# EAGLE schematic Sturingsschakeling_schema_v3.0 (EAGLE 9.7.0)
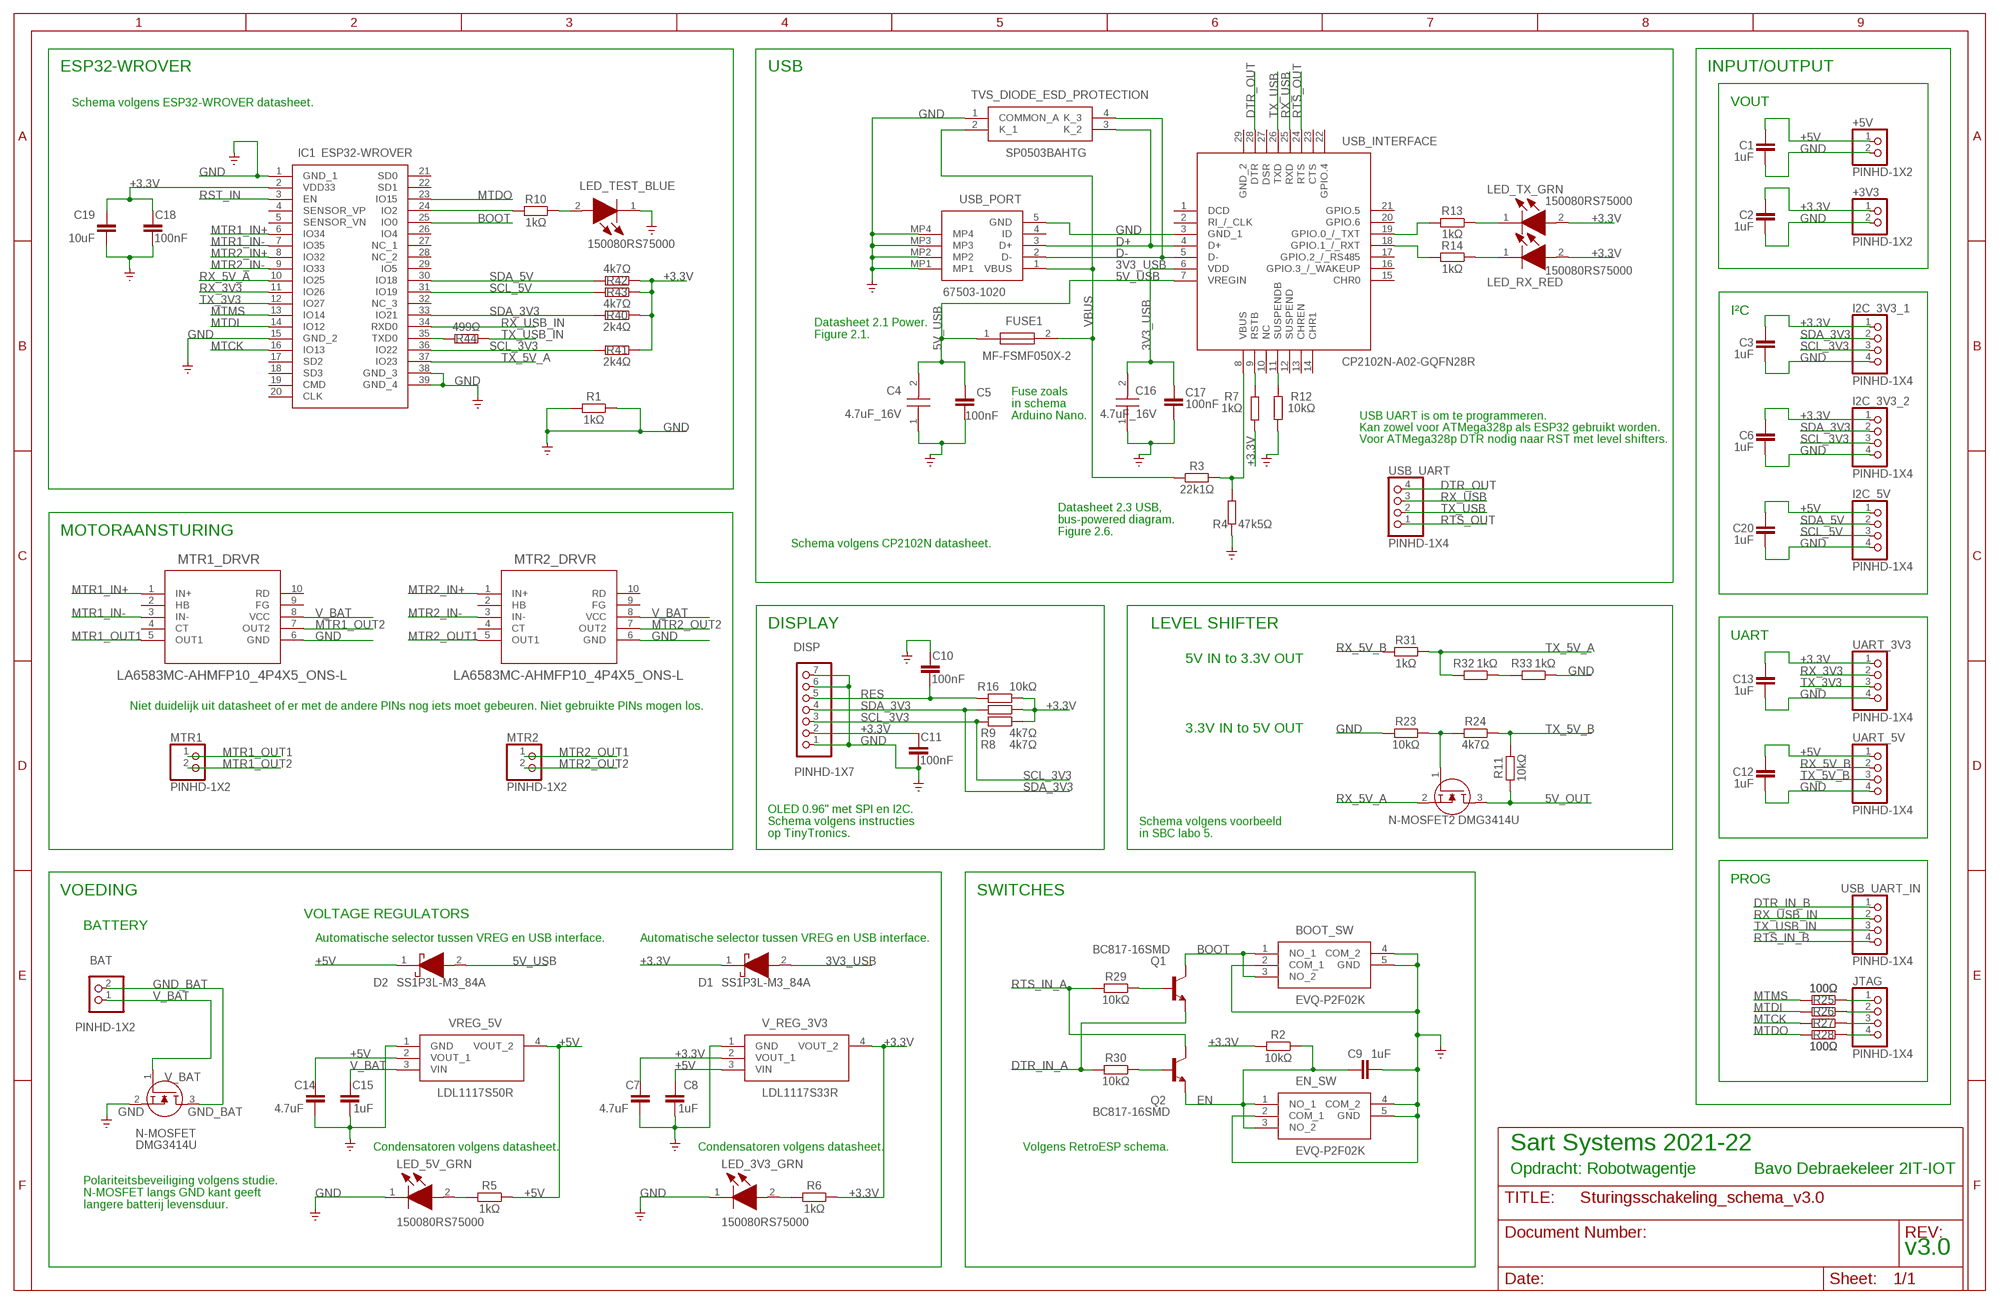
[diagram p0: schematic, sheet 1]

## Parts
+3V3  PINHD-1X2  [1X02]
+5V  PINHD-1X2  [1X02]
BAT  PINHD-1X2  [1X02]
BOOT_SW  EVQ-P2F02K  [EVQP2V02W]
C1  1uF  C_CHIP-0805(2012-METRIC)  [CAPC2012X110]
C2  1uF  C_CHIP-0805(2012-METRIC)  [CAPC2012X110]
C3  1uF  C_CHIP-0805(2012-METRIC)  [CAPC2012X110]
C4  4.7uF_16V  CC0805ZKY5V7BB475  [CAPC2012X145N]
C5  100nF  C_CHIP-0805(2012-METRIC)  [CAPC2012X110]
C6  1uF  C_CHIP-0805(2012-METRIC)  [CAPC2012X110]
C7  4.7uF  C_CHIP-0805(2012-METRIC)  [CAPC2012X110]
C8  1uF  C_CHIP-0805(2012-METRIC)  [CAPC2012X110]
C9  1uF  C_CHIP-0805(2012-METRIC)  [CAPC2012X110]
C10  100nF  C_CHIP-0805(2012-METRIC)  [CAPC2012X110]
C11  100nF  C_CHIP-0805(2012-METRIC)  [CAPC2012X110]
C12  1uF  C_CHIP-0805(2012-METRIC)  [CAPC2012X110]
C13  1uF  C_CHIP-0805(2012-METRIC)  [CAPC2012X110]
C14  4.7uF  C_CHIP-0805(2012-METRIC)  [CAPC2012X110]
C15  1uF  C_CHIP-0805(2012-METRIC)  [CAPC2012X110]
C16  4.7uF_16V  CC0805ZKY5V7BB475  [CAPC2012X145N]
C17  100nF  C_CHIP-0805(2012-METRIC)  [CAPC2012X110]
C18  100nF  C_CHIP-0805(2012-METRIC)  [CAPC2012X110]
C19  10uF  C_CHIP-0805(2012-METRIC)  [CAPC2012X110]
C20  1uF  C_CHIP-0805(2012-METRIC)  [CAPC2012X110]
D1  SS1P3L-M3_84A  [SS1P3LM384A]
D2  SS1P3L-M3_84A  [SS1P3LM384A]
DISP  PINHD-1X7  [1X07]
EN_SW  EVQ-P2F02K  [EVQP2V02W]
FUSE1  MF-FSMF050X-2  [FUSC1608X100N]
I2C_3V3_1  PINHD-1X4  [1X04]
I2C_3V3_2  PINHD-1X4  [1X04]
I2C_5V  PINHD-1X4  [1X04]
IC1  ESP32-WROVER  [ESP32WROVER]
JTAG  PINHD-1X4  [1X04]
LED_3V3_GRN  150080RS75000  [LEDC2012X80N]
LED_5V_GRN  150080RS75000  [LEDC2012X80N]
LED_RX_RED  150080RS75000  [LEDC2012X80N]
LED_TEST_BLUE  150080RS75000  [LEDC2012X80N]
LED_TX_GRN  150080RS75000  [LEDC2012X80N]
MTR1  PINHD-1X2  [1X02]
MTR1_DRVR  LA6583MC-AHMFP10_4P4X5_ONS-L  [MFP10_4P4X5_ONS-L]
MTR2  PINHD-1X2  [1X02]
MTR2_DRVR  LA6583MC-AHMFP10_4P4X5_ONS-L  [MFP10_4P4X5_ONS-L]
N-MOSFET  DMG3414U  [SOT96P240X110-3N]
N-MOSFET2  DMG3414U  [SOT96P240X110-3N]
Q1  BC817-16SMD  [SOT23-BEC]
Q2  BC817-16SMD  [SOT23-BEC]
R1  1kΩ  R_CHIP-0805(2012-METRIC)  [RESC2012X65]
R2  10kΩ  R_CHIP-0805(2012-METRIC)  [RESC2012X65]
R3  22k1Ω  R_CHIP-0805(2012-METRIC)  [RESC2012X65]
R4  47k5Ω  R_CHIP-0805(2012-METRIC)  [RESC2012X65]
R5  1kΩ  R_CHIP-0805(2012-METRIC)  [RESC2012X65]
R6  1kΩ  R_CHIP-0805(2012-METRIC)  [RESC2012X65]
R7  1kΩ  R_CHIP-0805(2012-METRIC)  [RESC2012X65]
R8  4k7Ω  R_CHIP-0805(2012-METRIC)  [RESC2012X65]
R9  4k7Ω  R_CHIP-0805(2012-METRIC)  [RESC2012X65]
R10  1kΩ  R_CHIP-0805(2012-METRIC)  [RESC2012X65]
R11  10kΩ  R_CHIP-0805(2012-METRIC)  [RESC2012X65]
R12  10kΩ  R_CHIP-0805(2012-METRIC)  [RESC2012X65]
R13  1kΩ  R_CHIP-0805(2012-METRIC)  [RESC2012X65]
R14  1kΩ  R_CHIP-0805(2012-METRIC)  [RESC2012X65]
R16  10kΩ  R_CHIP-0805(2012-METRIC)  [RESC2012X65]
R23  10kΩ  R_CHIP-0805(2012-METRIC)  [RESC2012X65]
R24  4k7Ω  R_CHIP-0805(2012-METRIC)  [RESC2012X65]
R25  100Ω  R_CHIP-0805(2012-METRIC)  [RESC2012X65]
R26  100Ω  R_CHIP-0805(2012-METRIC)  [RESC2012X65]
R27  100Ω  R_CHIP-0805(2012-METRIC)  [RESC2012X65]
R28  100Ω  R_CHIP-0805(2012-METRIC)  [RESC2012X65]
R29  10kΩ  R_CHIP-0805(2012-METRIC)  [RESC2012X65]
R30  10kΩ  R_CHIP-0805(2012-METRIC)  [RESC2012X65]
R31  1kΩ  R_CHIP-0805(2012-METRIC)  [RESC2012X65]
R32  1kΩ  R_CHIP-0805(2012-METRIC)  [RESC2012X65]
R33  1kΩ  R_CHIP-0805(2012-METRIC)  [RESC2012X65]
R40  2k4Ω  R_CHIP-0805(2012-METRIC)  [RESC2012X65]
R41  2k4Ω  R_CHIP-0805(2012-METRIC)  [RESC2012X65]
R42  4k7Ω  R_CHIP-0805(2012-METRIC)  [RESC2012X65]
R43  4k7Ω  R_CHIP-0805(2012-METRIC)  [RESC2012X65]
R44  499Ω  R_CHIP-0805(2012-METRIC)  [RESC2012X65]
TVS_DIODE_ESD_PROTECTION  SP0503BAHTG  [SP0503BAHTG]
UART_3V3  PINHD-1X4  [1X04]
UART_5V  PINHD-1X4  [1X04]
USB_INTERFACE  CP2102N-A02-GQFN28R  [QFN50P500X500X80-29N]
USB_PORT  67503-1020  [675031020]
USB_UART  PINHD-1X4  [1X04]
USB_UART_IN  PINHD-1X4  [1X04]
V_REG_3V3  LDL1117S33R  [SOT230P700X180-4N]
VREG_5V  LDL1117S50R  [SOT230P700X180-4N]

## Nets
3V3_USB: C16.2 C17.2 D1.2(A) USB_INTERFACE.6(VDD)
5V_OUT: N-MOSFET2.3(D) R11.2
5V_USB: C4.2 C5.2 D2.2(A) FUSE1.1 USB_INTERFACE.7(VREGIN)
+3.3V: +3V3.1 C2.2 C3.2 C6.2 C7.2 C11.2 C13.2 C18.2 C19.2 D1.1(K) DISP.2 I2C_3V3_1.1 I2C_3V3_2.1 IC1.2(VDD33) LED_RX_RED.2(A) LED_TX_GRN.2(A) R2.2 R6.1 R7.2 R8.1 R9.1 R16.1 R40.1 R41.1 R42.1 R43.1 UART_3V3.1 V_REG_3V3.2(VOUT_1) V_REG_3V3.4(VOUT_2)
+5V: +5V.1 C1.2 C8.2 C12.2 C14.2 C20.2 D2.1(K) I2C_5V.1 R5.1 UART_5V.1 V_REG_3V3.3(VIN) VREG_5V.2(VOUT_1) VREG_5V.4(VOUT_2)
BOOT: BOOT_SW.1(NO_1) BOOT_SW.3(NO_2) IC1.25(IO0) Q1.C
D+: TVS_DIODE_ESD_PROTECTION.3(K_2) USB_INTERFACE.4(D+) USB_PORT.3(D+)
D-: TVS_DIODE_ESD_PROTECTION.4(K_3) USB_INTERFACE.5(D-) USB_PORT.2(D-)
DTR_IN_A: Q1.E R30.2
DTR_IN_B: USB_UART_IN.1
DTR_OUT: USB_INTERFACE.28(DTR) USB_UART.4
EN: C9.2 EN_SW.1(NO_1) EN_SW.3(NO_2) Q2.E R2.1
GND: +3V3.2 +5V.2 BOOT_SW.2(COM_1) BOOT_SW.4(COM_2) BOOT_SW.5(GND) C1.1 C2.1 C3.1 C4.1 C5.1 C6.1 C7.1 C8.1 C9.1 C10.2 C11.1 C12.1 C13.1 C14.1 C15.1 C16.1 C17.1 C18.1 C19.1 C20.1 DISP.1 DISP.6 DISP.7 EN_SW.2(COM_1) EN_SW.4(COM_2) EN_SW.5(GND) I2C_3V3_1.4 I2C_3V3_2.4 I2C_5V.4 IC1.1(GND_1) IC1.15(GND_2) IC1.38(GND_3) IC1.39(GND_4) LED_3V3_GRN.1(K) LED_5V_GRN.1(K) LED_TEST_BLUE.1(K) MTR1_DRVR.6(GND) MTR2_DRVR.6(GND) N-MOSFET.2(S) R1.1 R1.2 R4.1 R12.1 R23.2 R33.1 TVS_DIODE_ESD_PROTECTION.1(COMMON_A) UART_3V3.4 UART_5V.4 USB_INTERFACE.3(GND_1) USB_PORT.5(GND) USB_PORT.MP1 USB_PORT.MP2 USB_PORT.MP3 USB_PORT.MP4 V_REG_3V3.1(GND) VREG_5V.1(GND) ; supply symbol labelled SUPPLY0_GND_
GND_BAT: BAT.2 N-MOSFET.3(D)
MTCK: IC1.16(IO13) R27.2
MTDI: IC1.14(IO12) R26.2
MTDO: IC1.23(IO15) R28.2
MTMS: IC1.13(IO14) R25.2
MTR1_IN+: IC1.6(IO34) MTR1_DRVR.1(IN+)
MTR1_IN-: IC1.7(IO35) MTR1_DRVR.3(IN-)
MTR1_OUT1: MTR1.1 MTR1_DRVR.5(OUT1)
MTR1_OUT2: MTR1.2 MTR1_DRVR.7(OUT2)
MTR2_IN+: IC1.8(IO32) MTR2_DRVR.1(IN+)
MTR2_IN-: IC1.9(IO33) MTR2_DRVR.3(IN-)
MTR2_OUT1: MTR2.1 MTR2_DRVR.5(OUT1)
MTR2_OUT2: MTR2.2 MTR2_DRVR.7(OUT2)
N$2: R3.2 R4.2 USB_INTERFACE.8(VBUS)
N$3: R7.1 USB_INTERFACE.9(RSTB)
N$6: JTAG.1 R25.1
N$7: LED_3V3_GRN.2(A) R6.2
N$8: LED_5V_GRN.2(A) R5.2
N$9: IC1.24(IO2) R10.2
N$10: LED_TEST_BLUE.2(A) R10.1
N$11: JTAG.2 R26.1
N$14: JTAG.3 R27.1
N$15: JTAG.4 R28.1
N$18: Q1.B R29.1
N$19: Q2.B R30.1
N$34: N-MOSFET2.1(G) R23.1 R24.2
N$35: R32.1 R33.2
N$38: IC1.35(TXD0) R44.2
N$39: R12.2 USB_INTERFACE.11(SUSPENDB)
N$40: LED_TX_GRN.1(K) R13.1
N$41: LED_RX_RED.1(K) R14.1
N$42: R13.2 USB_INTERFACE.19(GPIO.0_/_TXT)
N$43: R14.2 USB_INTERFACE.18(GPIO.1_/_RXT)
RES: C10.1 DISP.5 R16.2
RST_IN: IC1.3(EN)
RTS_IN_A: Q2.C R29.2
RTS_IN_B: USB_UART_IN.4
RTS_OUT: USB_INTERFACE.24(RTS) USB_UART.1
RX_3V3: IC1.11(IO26) UART_3V3.2
RX_5V_A: IC1.10(IO25) N-MOSFET2.2(S)
RX_5V_B: R31.2 UART_5V.2
RX_USB: USB_INTERFACE.25(RXD) USB_UART.3
RX_USB_IN: IC1.34(RXD0) USB_UART_IN.2
SCL_3V3: DISP.3 I2C_3V3_1.3 I2C_3V3_2.3 IC1.36(IO22) R9.2 R41.2
SCL_5V: I2C_5V.3 IC1.31(IO19) R43.2
SDA_3V3: DISP.4 I2C_3V3_1.2 I2C_3V3_2.2 IC1.33(IO21) R8.2 R40.2
SDA_5V: I2C_5V.2 IC1.30(IO18) R42.2
TX_3V3: IC1.12(IO27) UART_3V3.3
TX_5V_A: IC1.37(IO23) R31.1 R32.2
TX_5V_B: R11.1 R24.1 UART_5V.3
TX_USB: USB_INTERFACE.26(TXD) USB_UART.2
TX_USB_IN: R44.1 USB_UART_IN.3
V_BAT: BAT.1 C15.2 MTR1_DRVR.8(VCC) MTR2_DRVR.8(VCC) N-MOSFET.1(G) VREG_5V.3(VIN)
VBUS: FUSE1.2 R3.1 TVS_DIODE_ESD_PROTECTION.2(K_1) USB_PORT.1(VBUS)
Unconnected: IC1.4(SENSOR_VP) IC1.5(SENSOR_VN) IC1.17(SD2) IC1.18(SD3) IC1.19(CMD) IC1.20(CLK) IC1.21(SD0) IC1.22(SD1) IC1.26(IO4) IC1.27(NC_1) IC1.28(NC_2) IC1.29(IO5) IC1.32(NC_3) MTR1_DRVR.2(HB) MTR1_DRVR.4(CT) MTR1_DRVR.9(FG) MTR1_DRVR.10(RD) MTR2_DRVR.2(HB) MTR2_DRVR.4(CT) MTR2_DRVR.9(FG) MTR2_DRVR.10(RD) USB_INTERFACE.1(DCD) USB_INTERFACE.2(RI_/_CLK) USB_INTERFACE.10(NC) USB_INTERFACE.12(SUSPEND) USB_INTERFACE.13(CHREN) USB_INTERFACE.14(CHR1) USB_INTERFACE.15(CHR0) USB_INTERFACE.16(GPIO.3_/_WAKEUP) USB_INTERFACE.17(GPIO.2_/_RS485) USB_INTERFACE.20(GPIO.6) USB_INTERFACE.21(GPIO.5) USB_INTERFACE.22(GPIO.4) USB_INTERFACE.23(CTS) USB_INTERFACE.27(DSR) USB_INTERFACE.29(GND_2) USB_PORT.4(ID)

## Notes on the sheet
- ESP32-WROVER | USB | INPUT/OUTPUT
- Schema volgens ESP32-WROVER datasheet. | VOUT
- I²C
- Datasheet 2.1 Power.
  Figure 2.1.
- Fuse zoals
  in schema
  Arduino Nano.
- USB UART is om te programmeren.
- Kan zowel voor ATMega328p als ESP32 gebruikt worden.
- Voor ATMega328p DTR nodig naar RST met level shifters.
- MOTORAANSTURING
- Datasheet 2.3 USB,
  bus-powered diagram.
  Figure 2.6.
- Schema volgens CP2102N datasheet.
- DISPLAY | LEVEL SHIFTER
- UART
- 5V IN to 3.3V OUT
- Niet duidelijk uit datasheet of er met de andere PINs nog iets moet gebeuren. Niet gebruikte PINs mogen los.
- 3.3V IN to 5V OUT
- OLED 0.96" met SPI en I2C.
  Schema volgens instructies
  op TinyTronics.
- Schema volgens voorbeeld 
  in SBC labo 5.
- PROG
- VOEDING | SWITCHES
- VOLTAGE REGULATORS
- BATTERY
- Automatische selector tussen VREG en USB interface. | Automatische selector tussen VREG en USB interface.
- Condensatoren volgens datasheet. | Condensatoren volgens datasheet. | Volgens RetroESP schema. | Sart Systems 2021-22
- Opdracht: Robotwagentje | Bavo Debraekeleer 2IT-IOT
- Polariteitsbeveiliging volgens studie.
  N-MOSFET langs GND kant geeft 
  langere batterij levensduur.
- v3.0

## Library data of the parts
+3V3 +5V BAT MTR1 MTR2 = Connector:PINHD-1X2: PIN HEADER; CATEGORY: CONNECTOR; SUB-CATEGORY: PIN-HEADER
BOOT_SW EN_SW = EVQ-P2F02K:EVQ-P2F02K: Tactile Switches Light Touch Switch 4.7x3.5mm SMD midd Source: Datasheet <https://www.mouser.com/datasheet/2/315/sw_lt_eng_4735s-1288983.pdf>; DESCRIPTION: Tactile Switches Light Touch Switch 4.7x3.5mm SMD midd; HEIGHT: 2.5mm; MANUFACTURER_NAME: Panasonic; MANUFACTURER_PART_NUMBER: EVQ-P2F02K; MOUSER_PART_NUMBER: 667-EVQ-P2F02K; MOUSER_PRICE-STOCK: https://www.mouser.co.uk/ProductDetail/Panasonic/EVQ-P2F02K?qs=WwqriLBepZsV0QucKJ89rg%3D%3D
C1-C3 C5-C15 C17-C20 = Capacitor:C: Capacitor - Generic; CATEGORY: Capacitor
C4 C16 = CC0805ZKY5V7BB475:CC0805ZKY5V7BB475: YAGEO - CC0805ZKY5V7BB475 - SMD Multilayer Ceramic Capacitor, 4.7 F, 16 V, 0805 [2012 Metric], +80%, -20%, Y5V, CC Series Source: Datasheet <https://4donline.ihs.com/images/VipMasterIC/IC/YAGO/YAGO-S-A0004841839/YAGO-S-A0004841839-1.pdf?hkey=6D3A4C79FDBF58556ACFDE234799DDF0>; ARROW_PART_NUMBER: CC0805ZKY5V7BB475; ARROW_PRICE-STOCK: https://www.arrow.com/en/products/cc0805zky5v7bb475/yageo; DESCRIPTION: YAGEO - CC0805ZKY5V7BB475 - SMD Multilayer Ceramic Capacitor, 4.7 F, 16 V, 0805 [2012 Metric], +80%, -20%, Y5V, CC Series; HEIGHT: 1.45mm; MANUFACTURER_NAME: KEMET; MANUFACTURER_PART_NUMBER: CC0805ZKY5V7BB475; MOUSER_PART_NUMBER: 603-CC805ZKY5V7BB475; MOUSER_PRICE-STOCK: https://www.mouser.co.uk/ProductDetail/Yageo/CC0805ZKY5V7BB475?qs=7s%252B3O6pAiyA4wtTM471wUA%3D%3D
D1 D2 = SS1P3L-M3_84A:SS1P3L-M3_84A: Schottky Diodes & Rectifiers 30volt 1.0amp Low VF High Current Density Surface Mount Schottky Barrier Rectifiers Source: Datasheet <https://ms.componentsearchengine.com/Datasheets/2/SS1P3L-M3_84A.pdf>; ARROW_PART_NUMBER: SS1P3L-M3/84A; ARROW_PRICE-STOCK: https://www.arrow.com/en/products/ss1p3l-m384a/vishay?region=nac; DESCRIPTION: Schottky Diodes & Rectifiers 30volt 1.0amp Low VF High Current Density Surface Mount Schottky Barrier Rectifiers; HEIGHT: 1.15mm; MANUFACTURER_NAME: Vishay; MANUFACTURER_PART_NUMBER: SS1P3L-M3/84A; MOUSER_PART_NUMBER: 625-SS1P3L-M3/84A; MOUSER_PRICE-STOCK: https://www.mouser.co.uk/ProductDetail/Vishay-General-Semiconductor/SS1P3L-M3-84A?qs=HSPD0Bff7iZtYrbeCvAZDQ%3D%3D
DISP = Connector:PINHD-1X7: PIN HEADER; CATEGORY: CONNECTOR; SUB-CATEGORY: PIN-HEADER
FUSE1 = MF-FSMF050X-2:MF-FSMF050X-2: 0603 PTC Resettable Fuses, 6V, 500mA Bourns 0.5A Surface Mount Resettable Fuse, 6 V Source: Datasheet <http://uk.rs-online.com/web/p/products/6927633>; ARROW_PART_NUMBER: MF-FSMF050X-2; ARROW_PRICE-STOCK: https://www.arrow.com/en/products/mf-fsmf050x-2/bourns?region=nac; DESCRIPTION: 0603 PTC Resettable Fuses, 6V, 500mA Bourns 0.5A Surface Mount Resettable Fuse, 6 V; HEIGHT: 1mm; MANUFACTURER_NAME: Bourns; MANUFACTURER_PART_NUMBER: MF-FSMF050X-2; MOUSER_PART_NUMBER: 652-MFFSMF050X-2; MOUSER_PRICE-STOCK: https://www.mouser.co.uk/ProductDetail/Bourns/MF-FSMF050X-2?qs=3QkGRBNOvbrZekaW8Gqm4A%3D%3D
I2C_3V3_1 I2C_3V3_2 I2C_5V JTAG UART_3V3 UART_5V USB_UART USB_UART_IN = Connector:PINHD-1X4: PIN HEADER; CATEGORY: CONNECTOR; SUB-CATEGORY: PIN-HEADER
IC1 = ESP32-WROVER:ESP32-WROVER: WiFi Modules (802.11) SMD Module, ESP32-D0WDQ6, 64Mbits PSRAM, 32Mbits SPI flash, PCB Antenna Source: Datasheet <https://www.mouser.it/datasheet/2/891/esp32-wrover_datasheet_en-1223875.pdf>; DESCRIPTION: WiFi Modules (802.11) SMD Module, ESP32-D0WDQ6, 64Mbits PSRAM, 32Mbits SPI flash, PCB Antenna; HEIGHT: 3mm; MANUFACTURER_NAME: Espressif Systems; MANUFACTURER_PART_NUMBER: ESP32-WROVER; MOUSER_PART_NUMBER: 356-ESP32-WROVER
LED_3V3_GRN LED_5V_GRN LED_RX_RED LED_TEST_BLUE LED_TX_GRN = 150080RS75000:150080RS75000: LED,Wurth Elektronik,150080RS75000 Wurth Elektronik 150080RS75000, WL-SMCW Series Red LED, 625 nm 2012 (0805) Clear, Rectangle Lens SMD package Source: Datasheet <https://componentsearchengine.com/Datasheets/2/150080RS75000.pdf>; DESCRIPTION: LED,Wurth Elektronik,150080RS75000 Wurth Elektronik 150080RS75000, WL-SMCW Series Red LED, 625 nm 2012 (0805) Clear, Rectangle Lens SMD package; HEIGHT: 0.8mm; MANUFACTURER_NAME: Wurth Elektronik; MANUFACTURER_PART_NUMBER: 150080RS75000; MOUSER_PART_NUMBER: 710-150080RS75000; MOUSER_PRICE-STOCK: https://www.mouser.co.uk/ProductDetail/Wurth-Elektronik/150080RS75000?qs=LlUlMxKIyB2jdCo7bnfgew%3D%3D
MTR1_DRVR MTR2_DRVR = 2022-03-20_16-15-33_Library:LA6583MC-AH; COPYRIGHT: Copyright (C) 2022 Ultra Librarian. All rights reserved.; MANUFACTURER_PART_NUMBER: LA6583MC-AH; MFR_NAME: onsemi
N-MOSFET N-MOSFET2 = DMG3414U:DMG3414U: DIODES INC. - DMG3414U - MOSFET, N CH, W DIODE, 20V, 4.2A, SOT23 Source: Datasheet <https://componentsearchengine.com/Datasheets/2/DMG3414U.pdf>; DESCRIPTION: DIODES INC. - DMG3414U - MOSFET, N CH, W DIODE, 20V, 4.2A, SOT23; HEIGHT: 1.1mm; MANUFACTURER_NAME: Diodes Inc.; MANUFACTURER_PART_NUMBER: DMG3414U; MOUSER_PART_NUMBER: N/A; MOUSER_PRICE-STOCK: https://www.mouser.co.uk/ProductDetail/Diodes-Incorporated/DMG3414U?qs=Ledwo0gu0jiKJ4xsXSUnyQ%3D%3D
Q1 Q2 = transistor-npn:BC817*: NPN Transistor
R1-R14 R16 R23-R33 R40-R44 = Resistor:R: Resistor Fixed - Generic; CATEGORY: Resistor; SUB-CATEGORY: Fixed
TVS_DIODE_ESD_PROTECTION = SP0503BAHTG:SP0503BAHTG: ESD Suppressors / TVS Diodes TVS AVAL DIODE SMT Source: Datasheet <https://nl.mouser.com/datasheet/2/240/Littelfuse_TVS_Diode_Array_SP05_Datasheet.pdf-777043.pdf>; ARROW_PART_NUMBER: SP0503BAHTG; ARROW_PRICE-STOCK: https://www.arrow.com/en/products/sp0503bahtg/littelfuse?region=europe; DESCRIPTION: ESD Suppressors / TVS Diodes TVS AVAL DIODE SMT; HEIGHT: 1.22mm; MANUFACTURER_NAME: LITTELFUSE; MANUFACTURER_PART_NUMBER: SP0503BAHTG; MOUSER_PART_NUMBER: 576-SP0503BAHTG; MOUSER_PRICE-STOCK: https://www.mouser.co.uk/ProductDetail/Littelfuse/SP0503BAHTG?qs=uD%2FdkN7XIa0NTYXwHdELYA%3D%3D
USB_INTERFACE = CP2102N-A02-GQFN28R:CP2102N-A02-GQFN28R: USB Interface IC USB to UART bridge - QFN28 Source: Datasheet <https://www.silabs.com/documents/public/data-sheets/cp2102n-datasheet.pdf>; ARROW_PART_NUMBER: CP2102N-A02-GQFN28R; ARROW_PRICE-STOCK: https://www.arrow.com/en/products/cp2102n-a02-gqfn28r/silicon-labs?region=nac; DESCRIPTION: USB Interface IC USB to UART bridge - QFN28; HEIGHT: 0.8mm; MANUFACTURER_NAME: Silicon Labs; MANUFACTURER_PART_NUMBER: CP2102N-A02-GQFN28R; MOUSER_PART_NUMBER: 634-CP2102NA02QFN28R; MOUSER_PRICE-STOCK: https://www.mouser.co.uk/ProductDetail/Silicon-Labs/CP2102N-A02-GQFN28R?qs=u16ybLDytRag4qKvSH3fTw%3D%3D
USB_PORT = 67503-1020:67503-1020: USB Connectors USB Mini-B Recept On-The-Go Rt.Angle Source: Datasheet <https://www.molex.com/pdm_docs/sd/675031020_sd.pdf>; DESCRIPTION: USB Connectors USB Mini-B Recept On-The-Go Rt.Angle; HEIGHT: 4.05mm; MANUFACTURER_NAME: Molex; MANUFACTURER_PART_NUMBER: 67503-1020; MOUSER_PART_NUMBER: 538-67503-1020; MOUSER_PRICE-STOCK: https://www.mouser.co.uk/ProductDetail/Molex/67503-1020?qs=7zcQ9RRVJlhHWuXYKEhKMg%3D%3D
V_REG_3V3 = LDL1117S33R:LDL1117S33R: STMICROELECTRONICS - LDL1117S33R - LDO, FIXED, 3.3V, 1.2A, SOT-223-3 Source: Datasheet <https://componentsearchengine.com/Datasheets/2/LDL1117S33R.pdf>; ARROW_PART_NUMBER: LDL1117S33R; ARROW_PRICE-STOCK: https://www.arrow.com/en/products/ldl1117s33r/stmicroelectronics?region=nac; DESCRIPTION: STMICROELECTRONICS - LDL1117S33R - LDO, FIXED, 3.3V, 1.2A, SOT-223-3; HEIGHT: 1.8mm; MANUFACTURER_NAME: STMicroelectronics; MANUFACTURER_PART_NUMBER: LDL1117S33R; MOUSER_PART_NUMBER: 511-LDL1117S33R; MOUSER_PRICE-STOCK: https://www.mouser.co.uk/ProductDetail/STMicroelectronics/LDL1117S33R?qs=AQlKX63v8Rt9Bf6AWSrbFg%3D%3D
VREG_5V = LDL1117S50R:LDL1117S50R: STMICROELECTRONICS - LDL1117S50R - LDO, FIXED, 5V, 1.2A, SOT-223-3 Source: Datasheet <http://www.farnell.com/datasheets/2259188.pdf>; ARROW_PART_NUMBER: LDL1117S50R; ARROW_PRICE-STOCK: https://www.arrow.com/en/products/ldl1117s50r/stmicroelectronics?region=nac; DESCRIPTION: STMICROELECTRONICS - LDL1117S50R - LDO, FIXED, 5V, 1.2A, SOT-223-3; HEIGHT: 1.8mm; MANUFACTURER_NAME: STMicroelectronics; MANUFACTURER_PART_NUMBER: LDL1117S50R; MOUSER_PART_NUMBER: 511-LDL1117S50R; MOUSER_PRICE-STOCK: https://www.mouser.co.uk/ProductDetail/STMicroelectronics/LDL1117S50R?qs=AQlKX63v8RsuN9BQFiVf%2Fg%3D%3D